# EasyEDA schematic SCH_Pult-v1.0_2025-10-03.json

## Sheets
1 HighSpeed
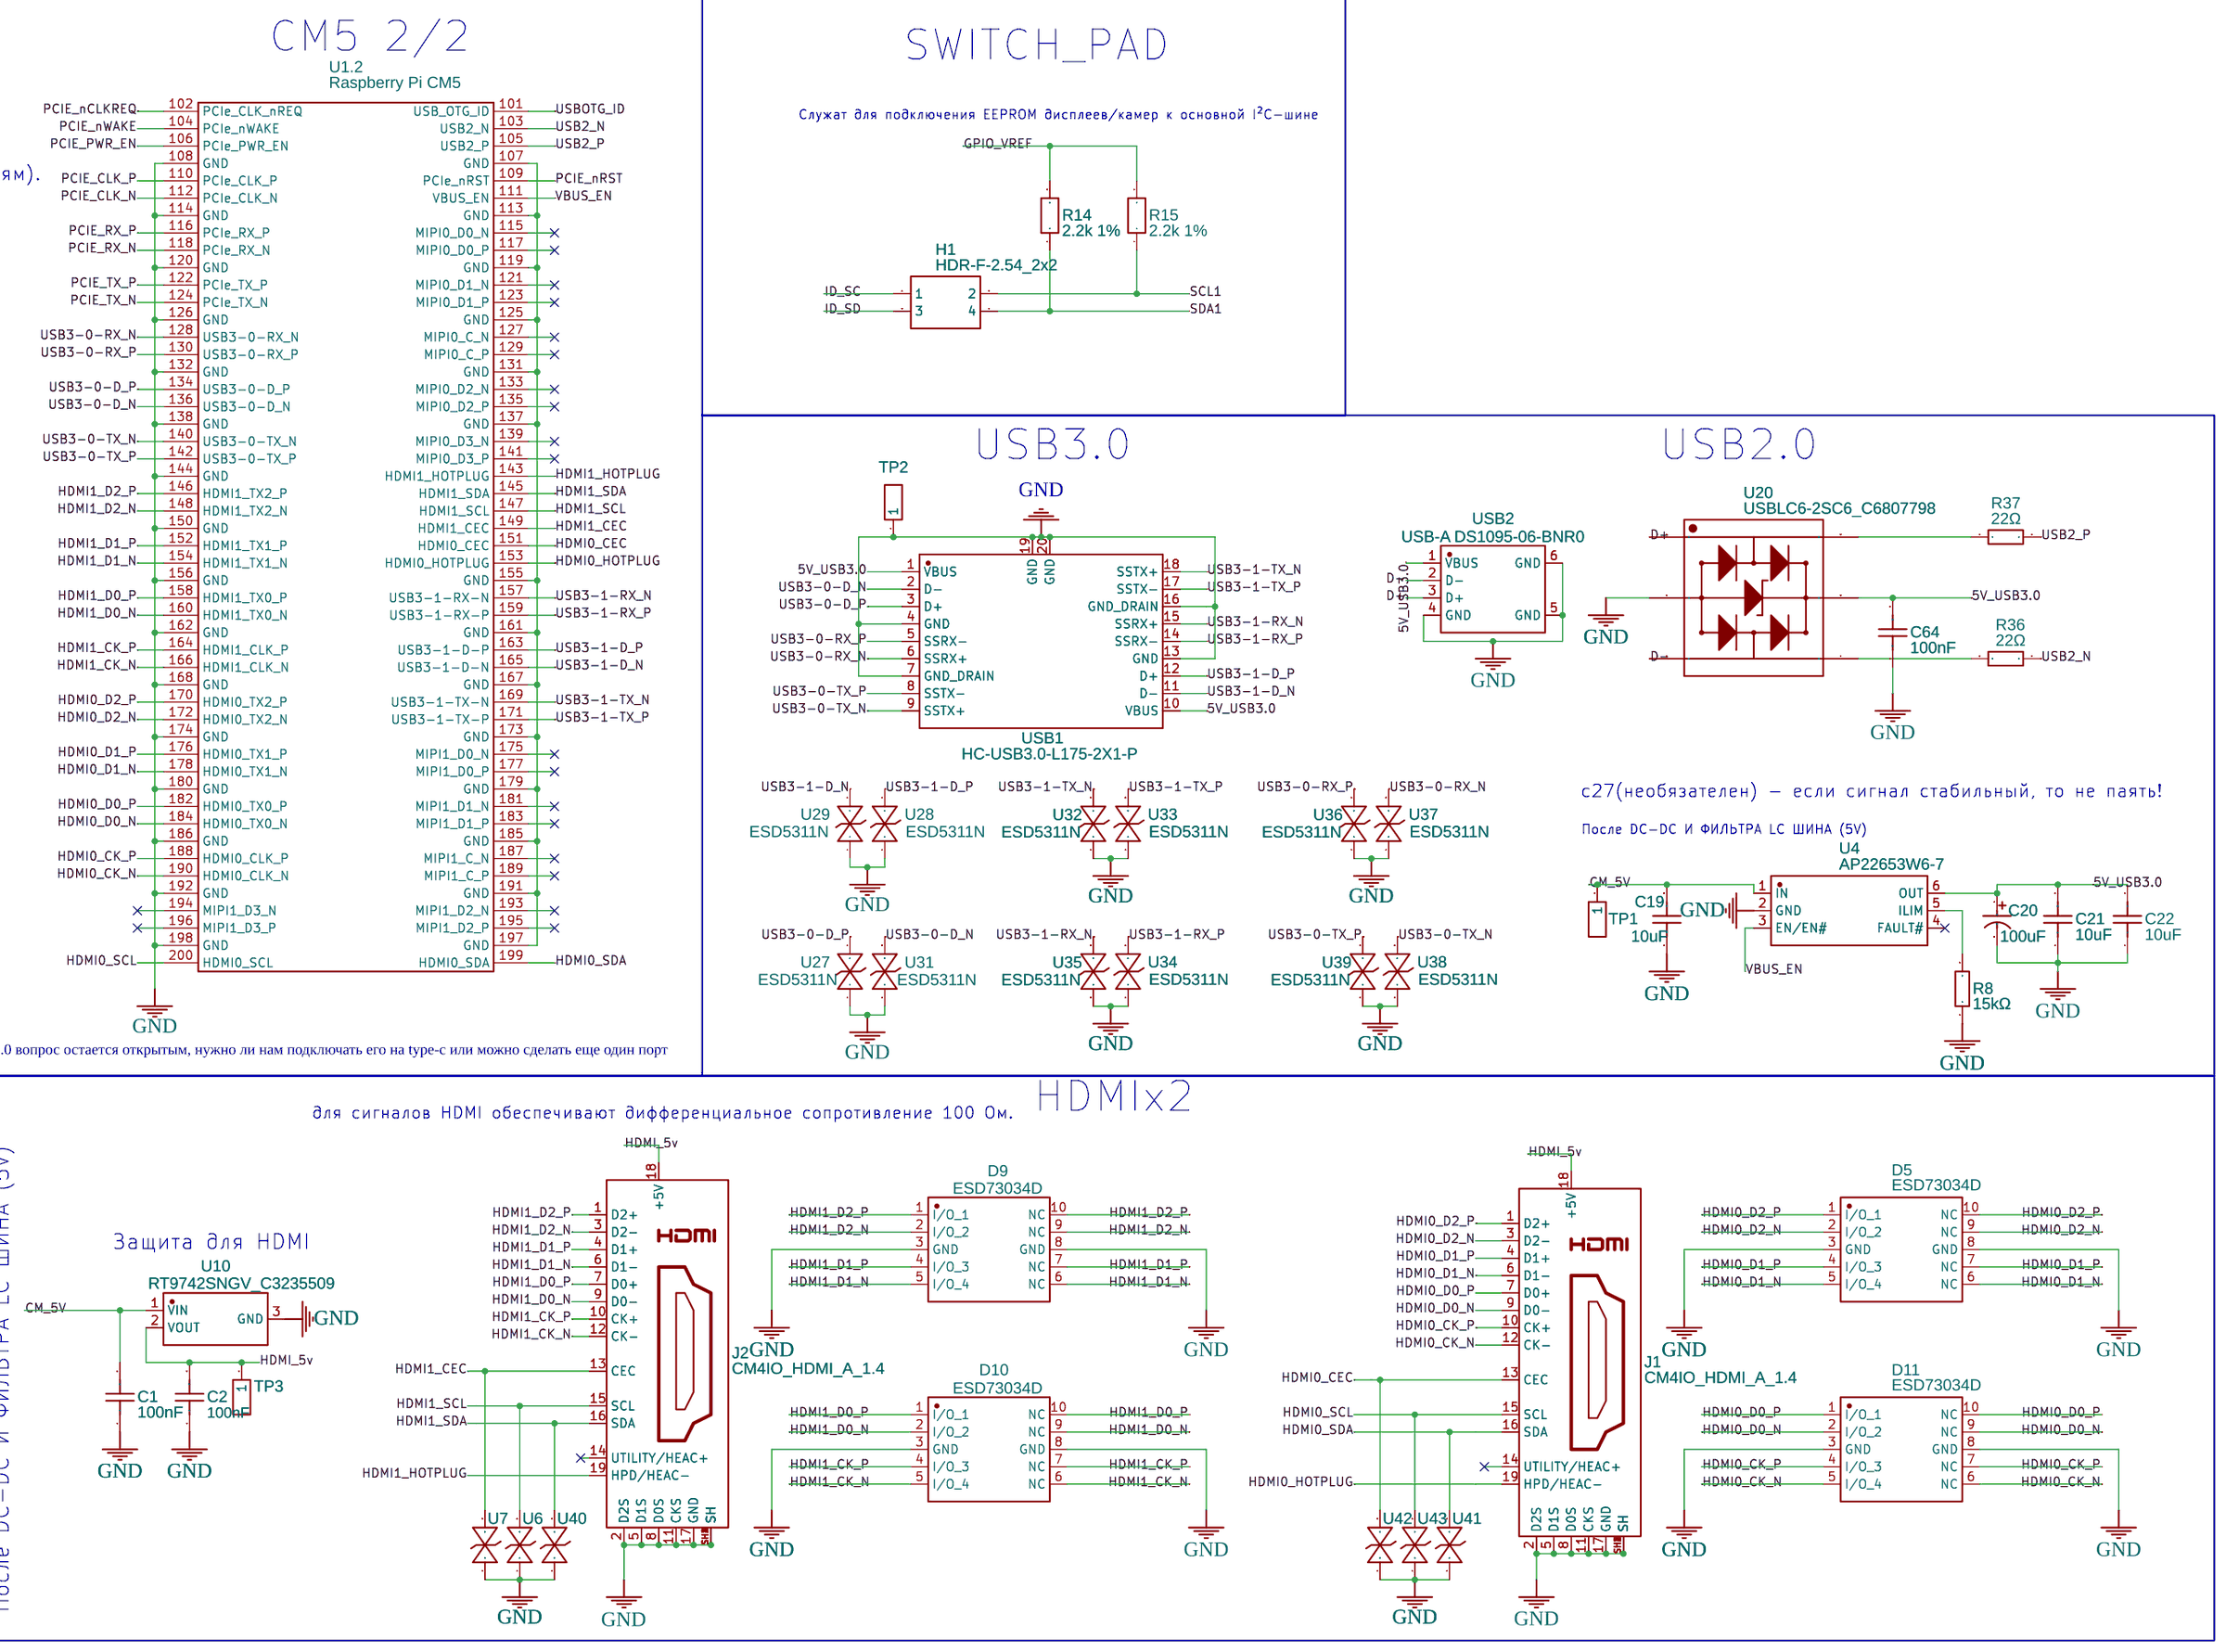
[diagram p0: HighSpeed]
2 Power Source ＆ Charging Circuit
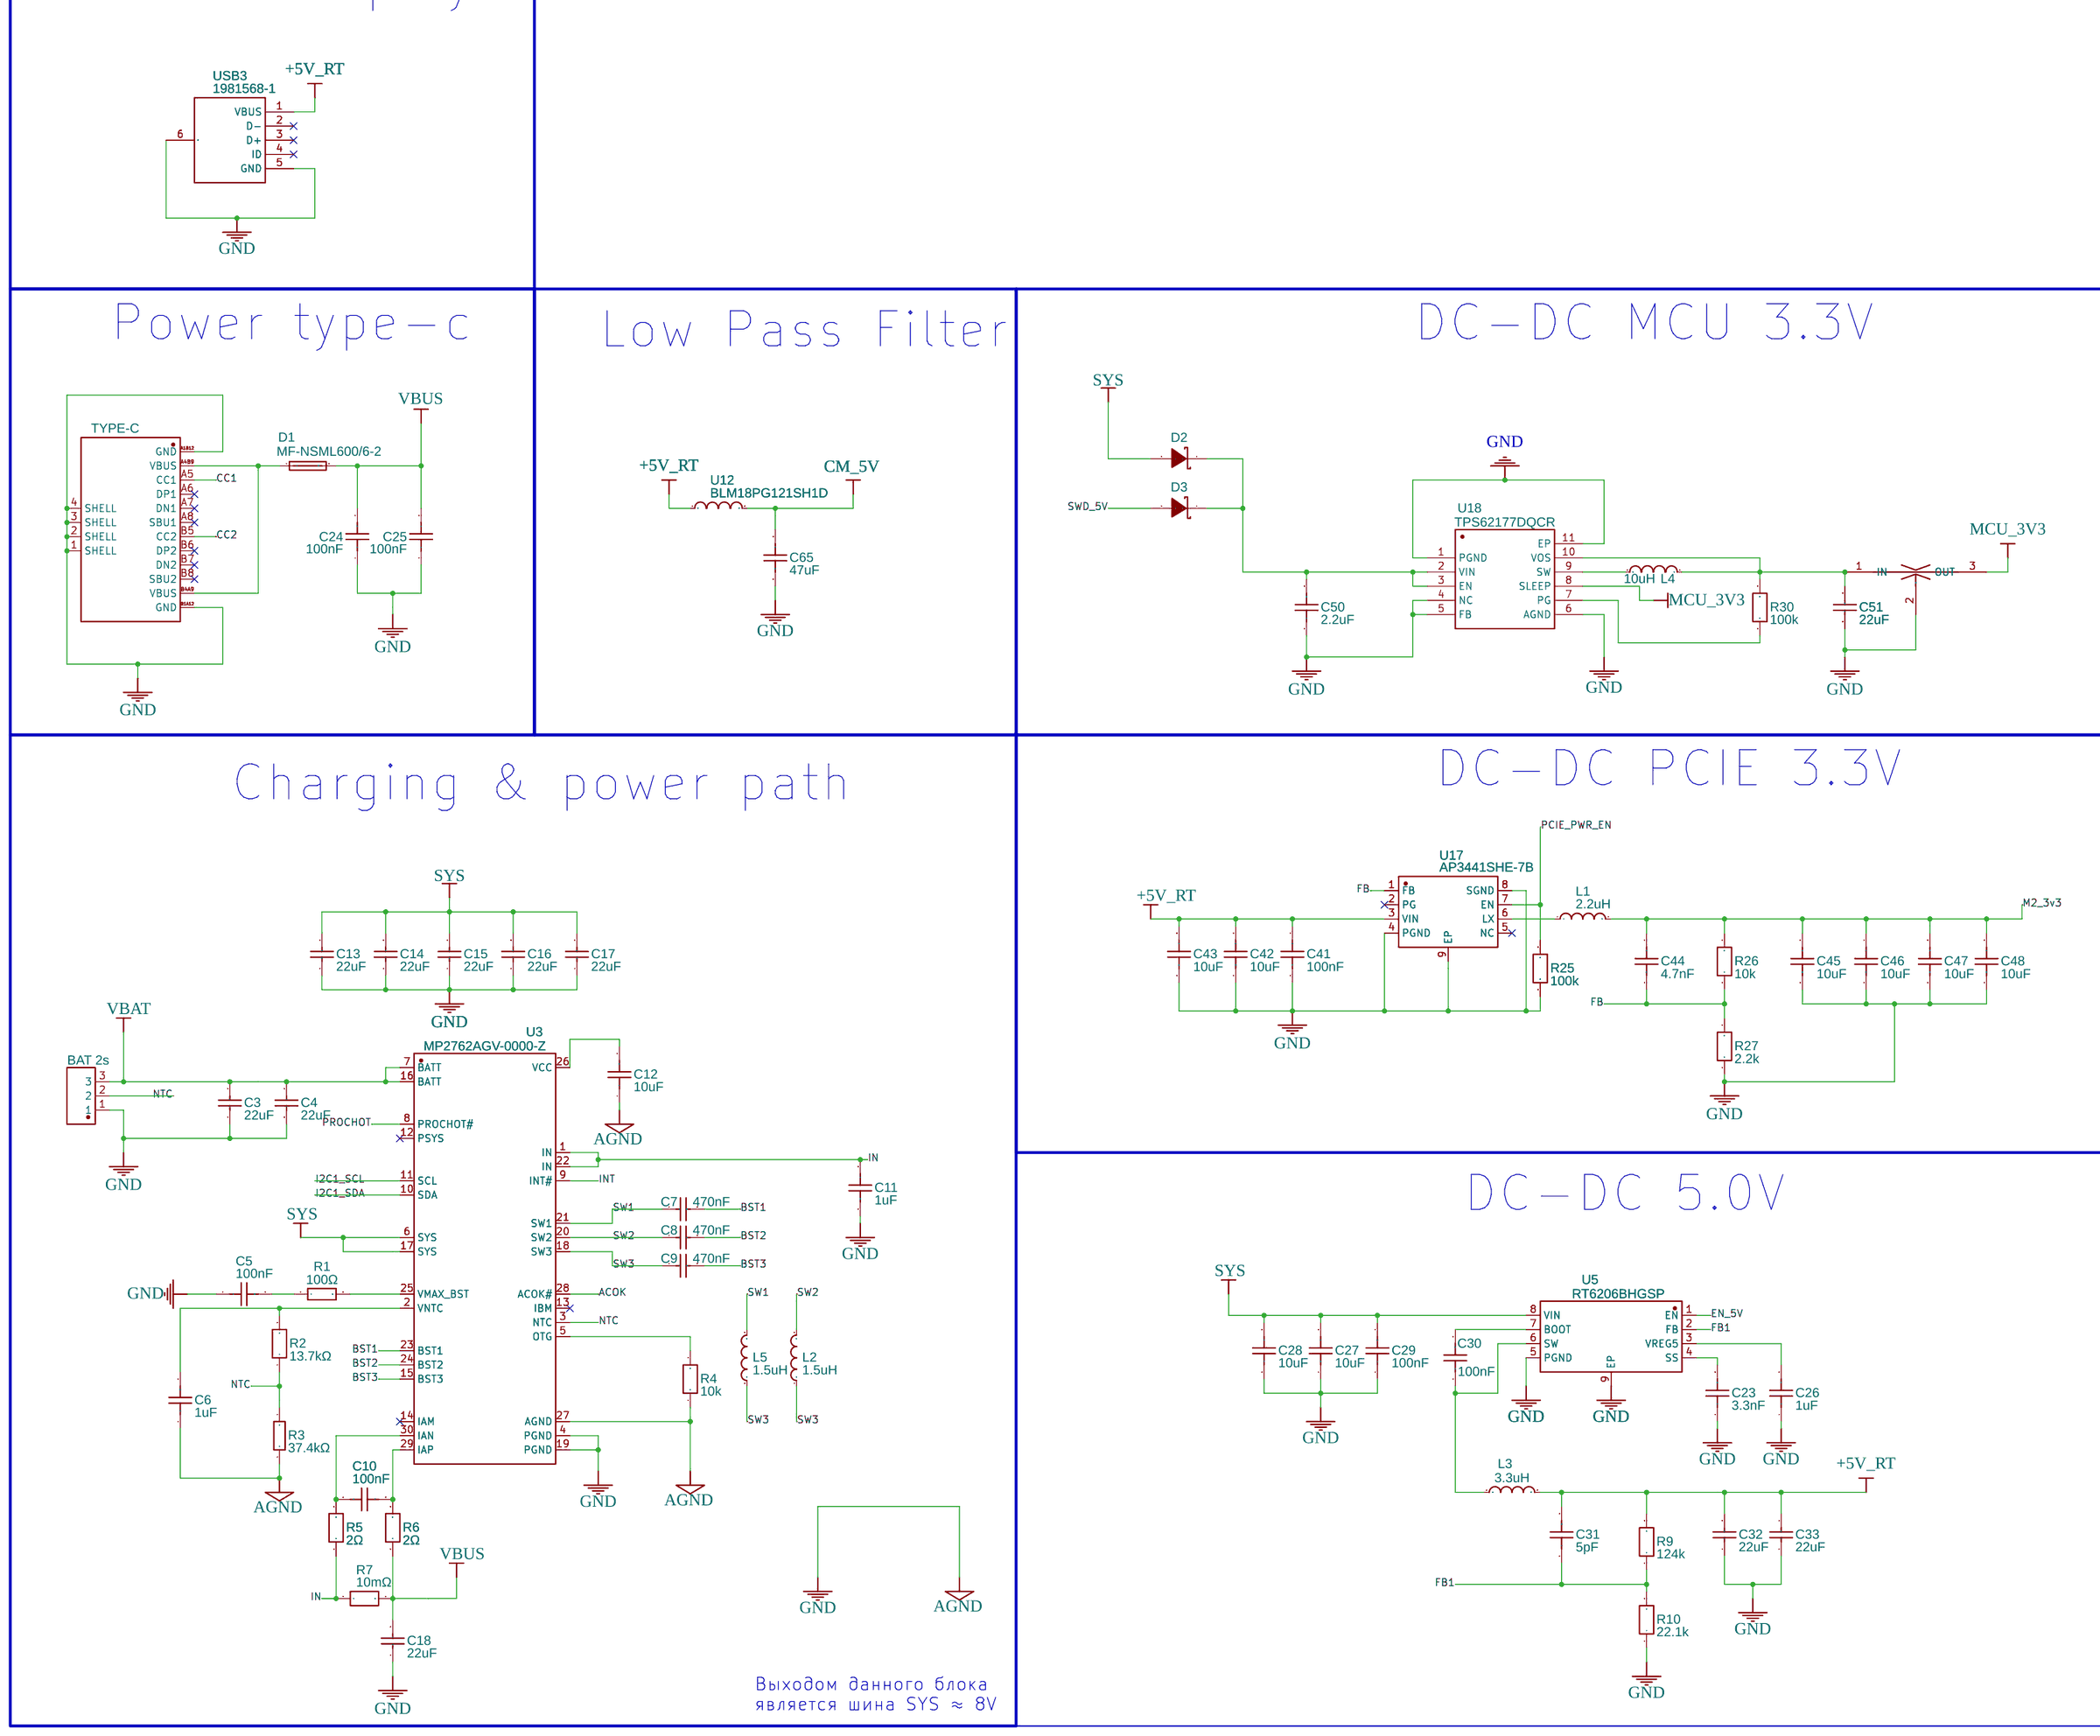
[diagram p1: Power Source ＆ Charging Circuit]
3 GPIO
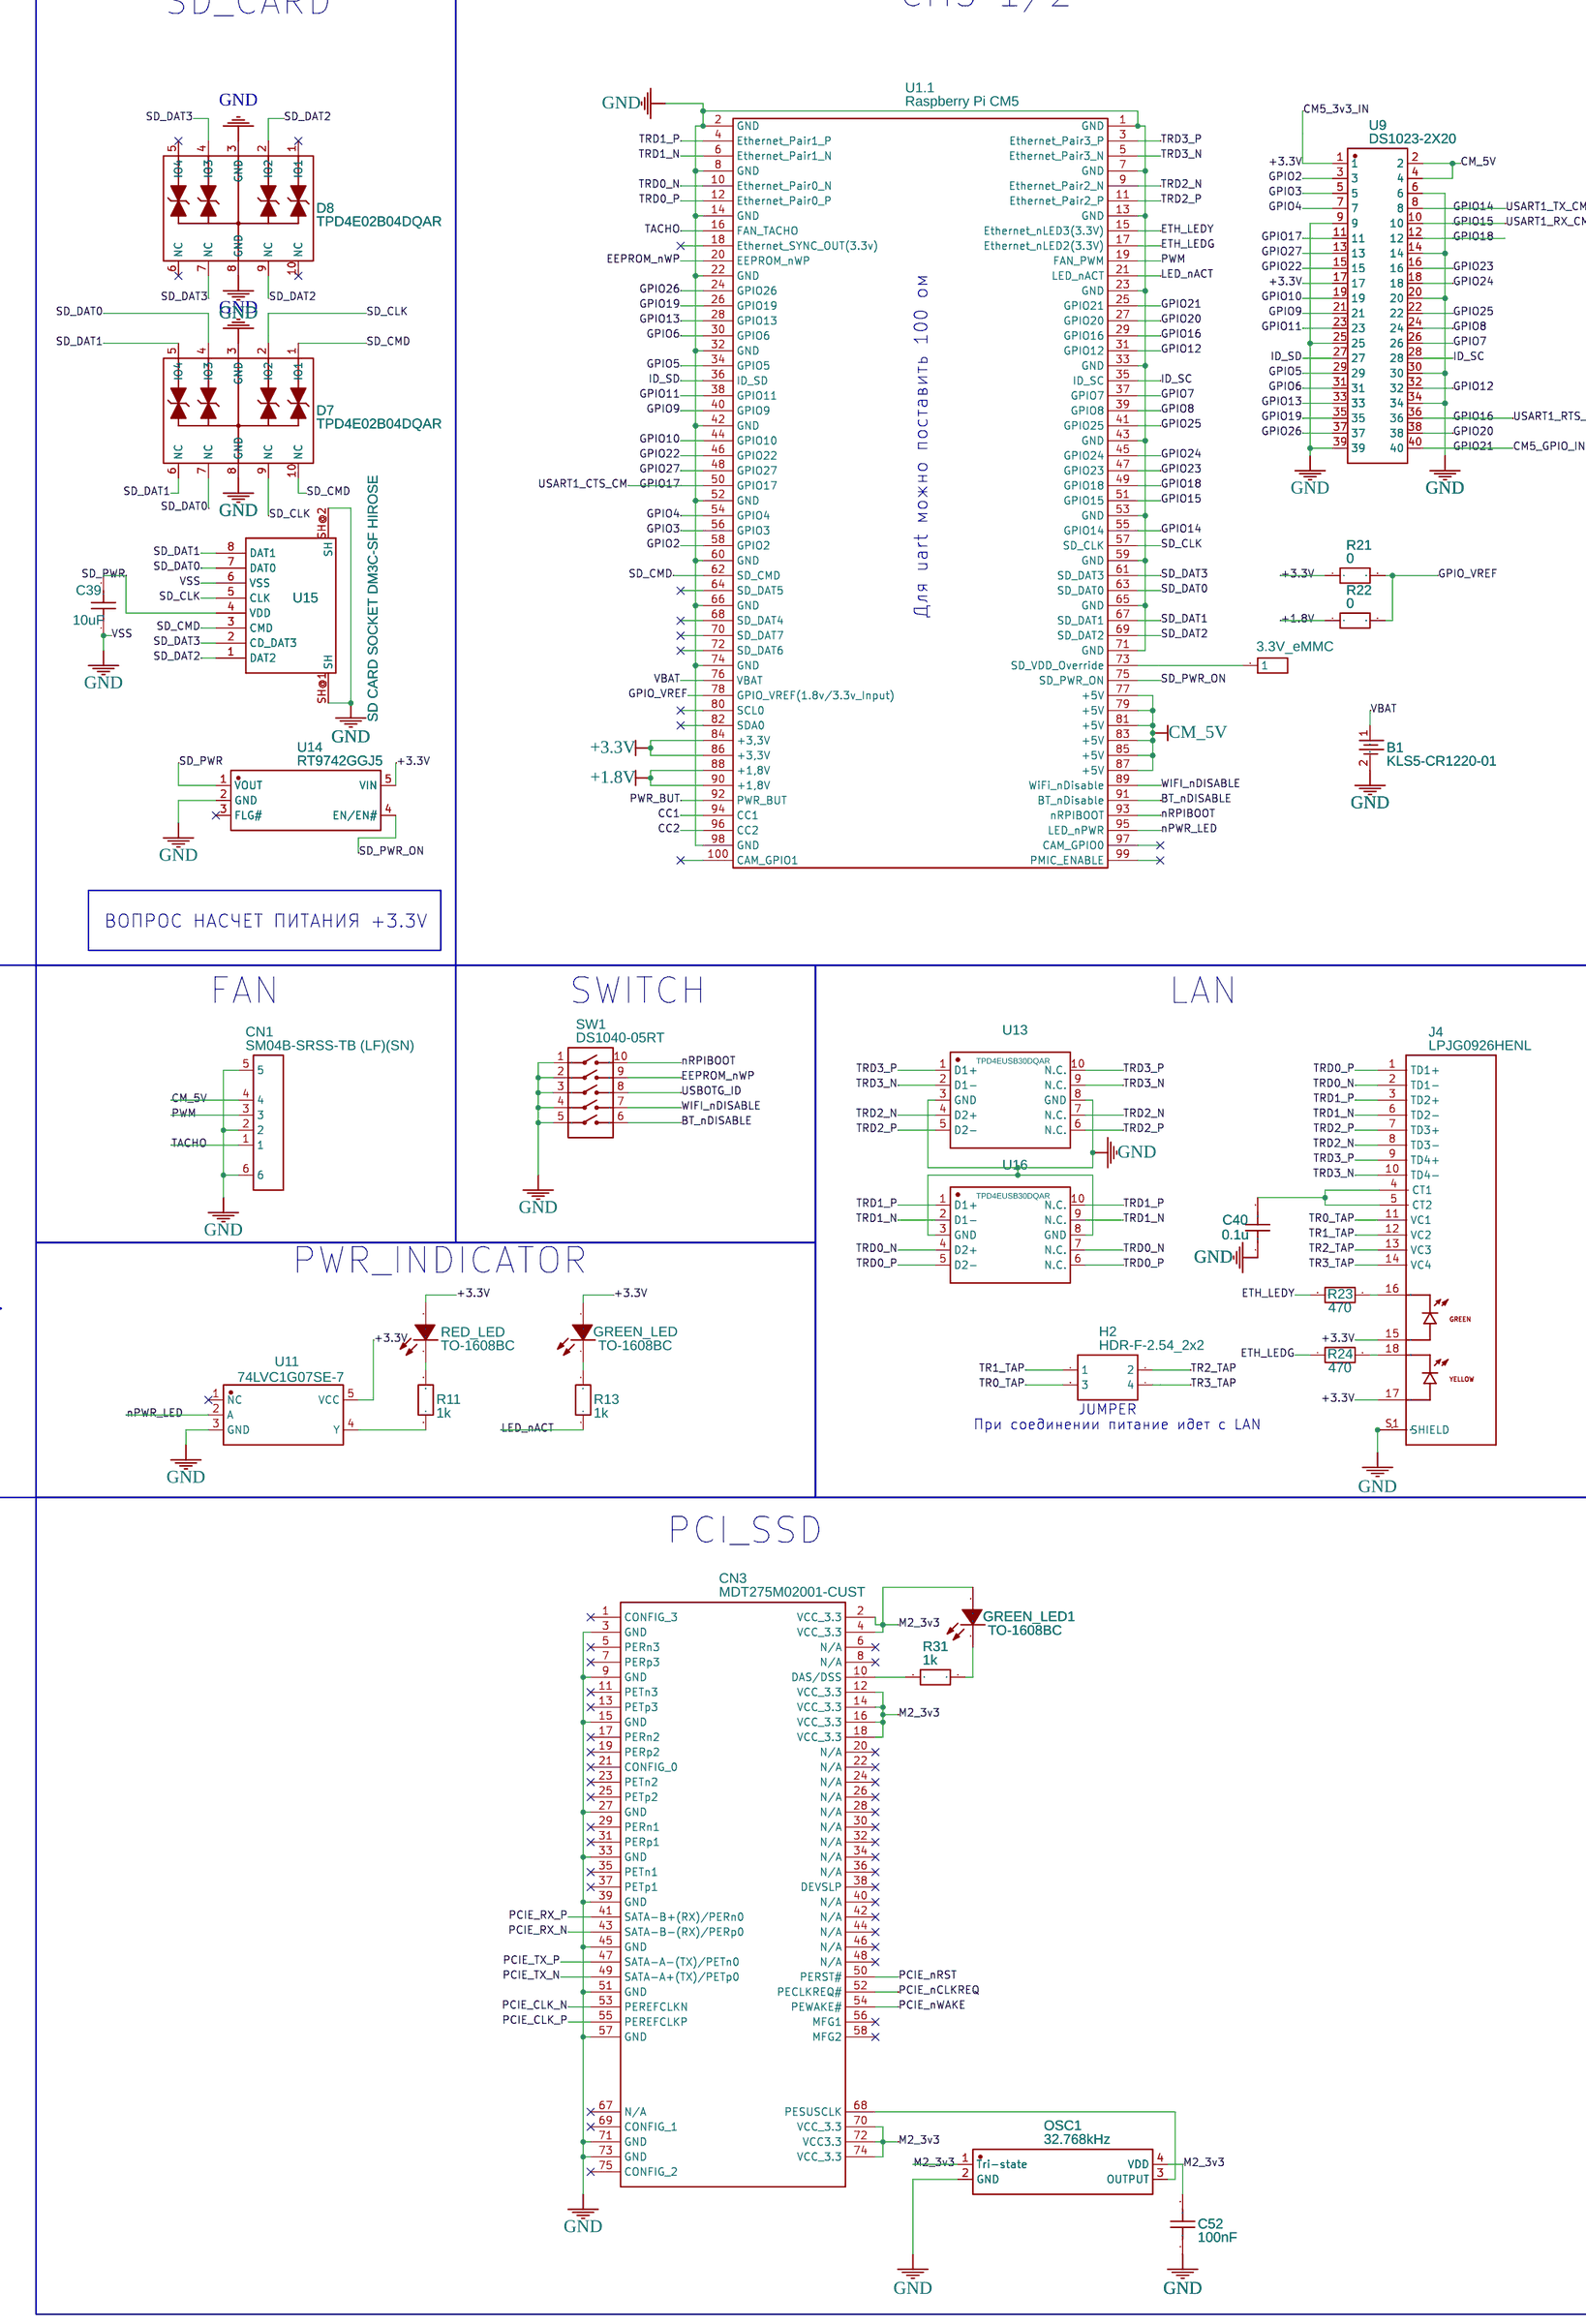
[diagram p2: GPIO]
4 MCU and Stick & Button
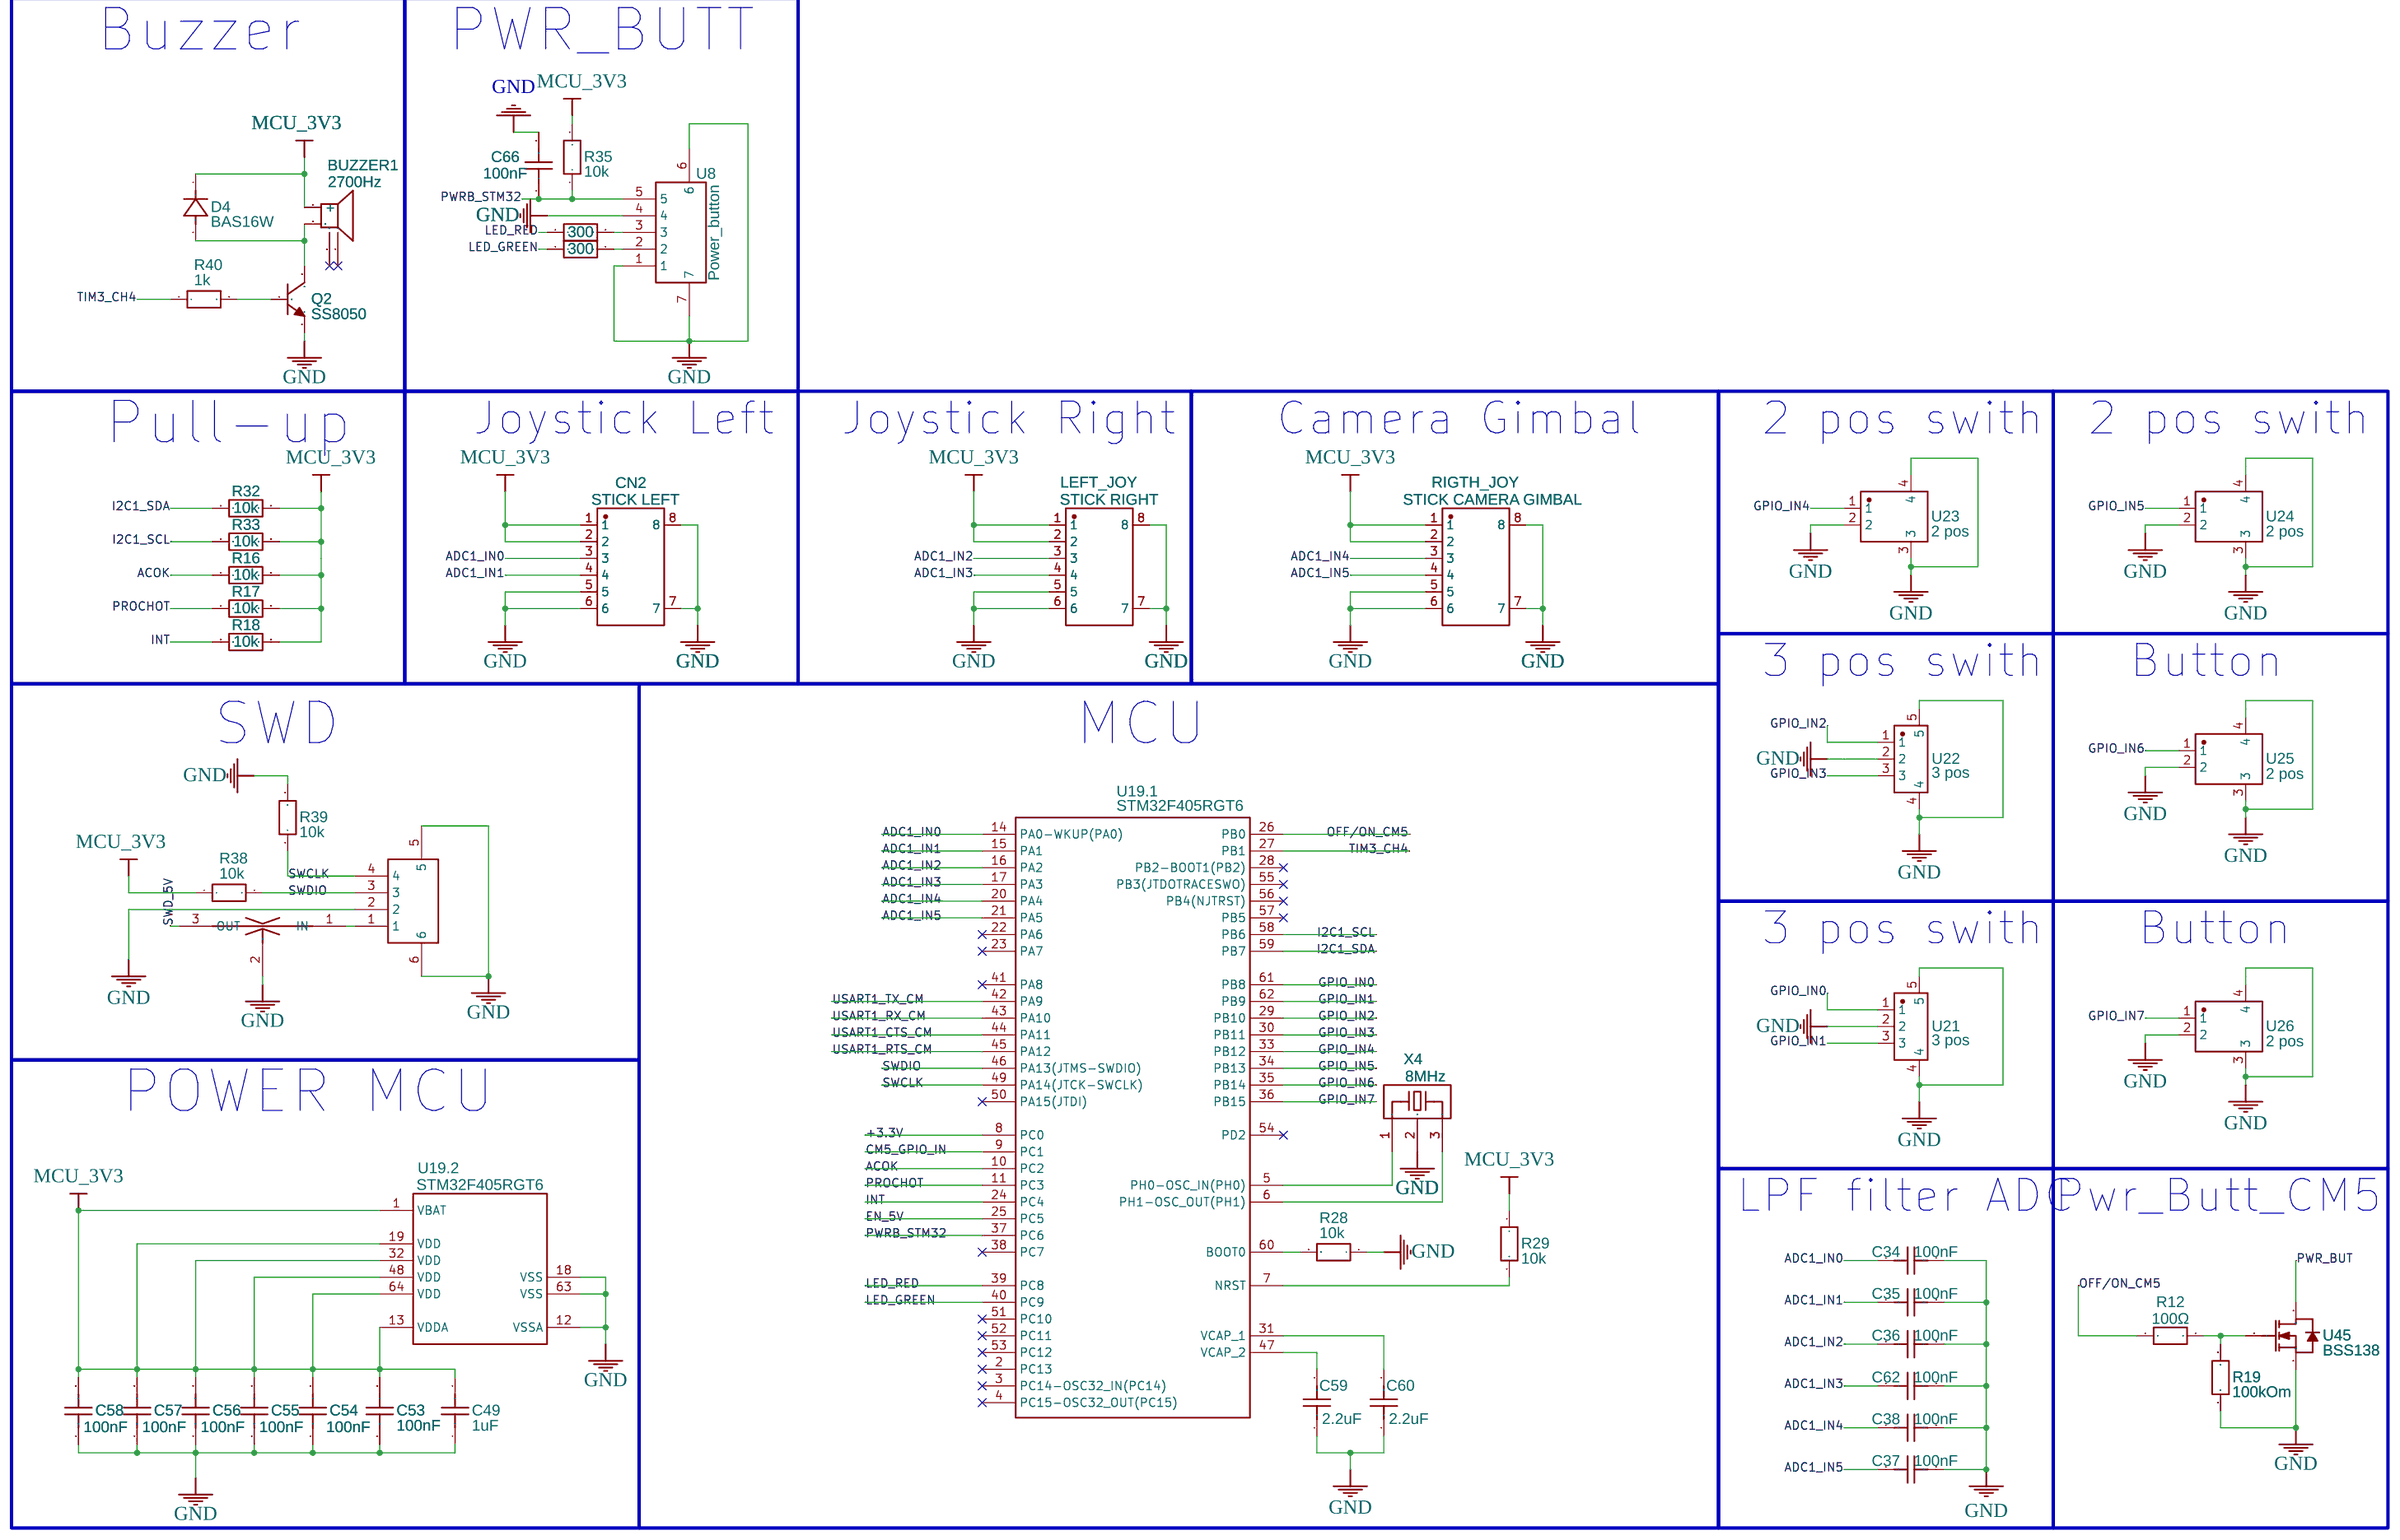
[diagram p3: MCU and Stick & Button]

## Parts
sheet GPIO
B1  KLS5-CR1220-01  [KLS5-CR1220-01]
C39  10uF  [C0603]
C40  0.1u  [C0603]
C52  100nF  [C0603]
CN1  SM04B-SRSS-TB (LF)(SN)  [CONN-SMD_4P-P1.00_SM04B-SRSS-TB-LF-SN]
CN3  MDT275M02001-CUST  [MDT275M02001]
D7  TPD4E02B04DQAR  [USON-10_L2.5-W1.0-P0.50-BL]
D8  TPD4E02B04DQAR  [USON-10_L2.5-W1.0-P0.50-BL]
GREEN_LED  TO-1608BC  [TO-1608BC-MRE]
GREEN_LED1  TO-1608BC  [TO-1608BC-MRE]
H2  HDR-F-2.54_2x2  [HDR-F-2.54_2X2]
J3  3.3V_eMMC  [HDR-M-2.54_1X1]
J4  LPJG0926HENL  [LINK-PP_LPJG0926HENL]
OSC1  32.768kHz  [OSC-SMD_4P-L3.2-W2.5-BL-1]
R11  1k  [R0603]
R13  1k  [R0603]
R21  0  [R0603]
R22  0  [R0603]
R23  470  [R0603]
R24  470  [R0603]
R31  1k  [R0603]
RED_LED  TO-1608BC  [TO-1608BC-MRE]
SW1  DS1040-05RT  [SW-TH_10P-P2.54_DS1040-05RN]
U1  Raspberry Pi CM5  [RASPBERRY_PI_CM5]  (sections 1,2)
U9  DS1023-2X20  [HDR-TH_40P-P2.00-V-F-R2-C20-S2.00]
U11  74LVC1G07SE-7  [SC-88A_L2.0-W1.3-P0.65-LS2.1-BL]
U13  TPD4EUSB30DQAR  [USON-10_L2.5-W1.0-P0.50-BL]
U14  RT9742GGJ5  [TSOT-23-5_L2.9-W1.6-P0.95-LS2.8-BR]
U15  SD CARD SOCKET DM3C-SF HIROSE  [SD_1:1]
U16  TPD4EUSB30DQAR  [USON-10_L2.5-W1.0-P0.50-BL]
sheet HighSpeed
C1  100nF  [C0603]
C2  100nF  [C0603]
C19  10uF  [C0603]
C20  100uF  [CAP-SMD_BD6.3-L6.6-W6.6-LS7.6-FD]
C21  10uF  [C0603]
C22  10uF  [C0603]
C64  100nF  [C0402]
D5  ESD73034D  [DFN-10_L2.5-W1.0-P0.50-BL-2]
D9  ESD73034D  [DFN-10_L2.5-W1.0-P0.50-BL-2]
D10  ESD73034D  [DFN-10_L2.5-W1.0-P0.50-BL-2]
D11  ESD73034D  [DFN-10_L2.5-W1.0-P0.50-BL-2]
H1  HDR-F-2.54_2x2  [HDR-F-2.54_2X2]
J1  CM4IO_HDMI_A_1.4  [CM4IO:EDAC 690-019-298-412]
J2  CM4IO_HDMI_A_1.4  [CM4IO:EDAC 690-019-298-412]
R8  15kΩ  [R0603]
R14  2.2k 1%  [R0603]
R15  2.2k 1%  [R0603]
R36  22Ω  [R0402]
R37  22Ω  [R0402]
TP1  HDR-M-2.54_1x1  [HDR-M-2.54_1X1]
TP2  HDR-M-2.54_1x1  [HDR-M-2.54_1X1]
TP3  HDR-M-2.54_1x1  [HDR-M-2.54_1X1]
U4  AP22653W6-7  [SOT-23-6_L2.9-W1.6-P0.95-LS2.8-BR]
U6  ESD5311N  [DFN1006-2L-BI]
U7  ESD5311N  [DFN1006-2L-BI]
U10  RT9742SNGV_C3235509  [SOT-23-3_L2.9-W1.6-P1.90-LS2.8-BR]
U20  USBLC6-2SC6_C6807798  [SOT-23-6_L2.9-W1.6-P0.95-LS2.8-BL]
U27  ESD5311N  [DFN1006-2L-BI]
U28  ESD5311N  [DFN1006-2L-BI]
U29  ESD5311N  [DFN1006-2L-BI]
U31  ESD5311N  [DFN1006-2L-BI]
U32  ESD5311N  [DFN1006-2L-BI]
U33  ESD5311N  [DFN1006-2L-BI]
U34  ESD5311N  [DFN1006-2L-BI]
U35  ESD5311N  [DFN1006-2L-BI]
U36  ESD5311N  [DFN1006-2L-BI]
U37  ESD5311N  [DFN1006-2L-BI]
U38  ESD5311N  [DFN1006-2L-BI]
U39  ESD5311N  [DFN1006-2L-BI]
U40  ESD5311N  [DFN1006-2L-BI]
U41  ESD5311N  [DFN1006-2L-BI]
U42  ESD5311N  [DFN1006-2L-BI]
U43  ESD5311N  [DFN1006-2L-BI]
USB1  HC-USB3.0-L175-2X1-P  [USB-A-TH_H181-AF2R06-12ALCR]
USB2  USB-A DS1095-06-BNR0  [USB-A DS1095-06-BNR)]
sheet MCU and Stick & Button
BUZZER1  2700Hz  [BUZ-SMD_4P-L8.5-W8.5-P8.50-BR]
C34  100nF  [C0603]
C35  100nF  [C0603]
C36  100nF  [C0603]
C37  100nF  [C0603]
C38  100nF  [C0603]
C49  1uF  [C0603]
C53  100nF  [C0603]
C54  100nF  [C0603]
C55  100nF  [C0603]
C56  100nF  [C0603]
C57  100nF  [C0603]
C58  100nF  [C0603]
C59  2.2uF  [C0603]
C60  2.2uF  [C0603]
C61  -  [FILTER-SMD_3P-L1.6-W0.8-L_NFM18CC223R1C3D]
C62  100nF  [C0603]
C66  100nF  [C0603]
CN2  STICK LEFT  [CONN-TH_SM06B-GHS-TB-LF-SN]
D4  BAS16W  [SOD-123_L2.7-W1.6-LS3.7-RD]
LEFT_JOY  STICK RIGHT  [CONN-TH_SM06B-GHS-TB-LF-SN]
Q2  SS8050  [SOT-23-3_L2.9-W1.3-P1.90-LS2.4-BR]
R12  100Ω  [R0402]
R16  10k  [R0603]
R17  10k  [R0603]
R18  10k  [R0603]
R19  100kOm  [R0402]
R20  300  [R0603]
R28  10k  [R0603]
R29  10k  [R0603]
R32  10k  [R0603]
R33  10k  [R0603]
R34  300  [R0603]
R35  10k  [R0603]
R38  10k  [R0603]
R39  10k  [R0603]
R40  1k  [R0603]
RIGTH_JOY  STICK CAMERA GIMBAL  [CONN-TH_SM06B-GHS-TB-LF-SN]
U8  Power_button  [CONN-SMD_5P-P1.25_SM05B-GHS-TB-LF-SN]
U19  STM32F405RGT6  [LQFP-64_L10.0-W10.0-P0.50-LS12.0-BL]  (sections 1,2)
U21  3 pos  [CONN-TH_SM03B-GHS-TB-LF-SN]
U22  3 pos  [CONN-TH_SM03B-GHS-TB-LF-SN]
U23  2 pos  [CONN-SMD_SM02B-GHS-TB-LF-SN]
U24  2 pos  [CONN-SMD_SM02B-GHS-TB-LF-SN]
U25  2 pos  [CONN-SMD_SM02B-GHS-TB-LF-SN]
U26  2 pos  [CONN-SMD_SM02B-GHS-TB-LF-SN]
U30  SM04B-GHS-TB(LF)(SN)  [CONN-SMD_4P-P1.25_SM04B-GHS-TB-LF-SN]
U45  BSS138  [SOT-23-3_L2.9-W1.4-P1.90-LS2.5-BR]
X4  8MHz  [OSC-SMD_3P-L3.2-W1.3-P1.2-L]
sheet Power Source ＆ Charging Circuit
C3  22uF  [C0805]
C4  22uF  [C0805]
C5  100nF  [C0603]
C6  1uF  [C0603]
C7  470nF  [C0603]
C8  470nF  [C0603]
C9  470nF  [C0603]
C10  100nF  [C0603]
C11  1uF  [C0603]
C12  10uF  [C0603]
C13  22uF  [C0805]
C14  22uF  [C0805]
C15  22uF  [C0805]
C16  22uF  [C0805]
C17  22uF  [C0805]
C18  22uF  [C0805]
C23  3.3nF  [C0603]
C24  100nF  [C0603]
C25  100nF  [C0603]
C26  1uF  [C0603]
C27  10uF  [C0603]
C28  10uF  [C0603]
C29  100nF  [C0603]
C30  100nF  [C0603]
C31  5pF  [C0603]
C32  22uF  [C0805]
C33  22uF  [C0805]
C41  100nF  [C0603]
C42  10uF  [C0603]
C43  10uF  [C0603]
C44  4.7nF  [C0603]
C45  10uF  [C0603]
C46  10uF  [C0603]
C47  10uF  [C0603]
C48  10uF  [C0603]
C50  2.2uF  [C0603]
C51  22uF  [C0805]
C63  -  [FILTER-SMD_3P-L1.6-W0.8-L_NFM18CC223R1C3D]
C65  47uF  [C0603]
D1  MF-NSML600/6-2  [F1206]
D2  BAT60AE6327HTSA1  [SOD-323_L1.8-W1.3-LS2.5-RD]
D3  BAT60AE6327HTSA1  [SOD-323_L1.8-W1.3-LS2.5-RD]
L1  2.2uH  [IND-SMD_L3.0-W3.0_IHLP-1212BZ]
L2  1.5uH  [IND-SMD_L5.5-W5.2]
L3  3.3uH  [IND-SMD_L6.5-W6.5_IHLP-2525]
L4  10uH  [IND-SMD_L4.0-W4.0_VLCF4020]
L5  1.5uH  [IND-SMD_L5.5-W5.2]
R1  100Ω  [R0603]
R2  13.7kΩ  [R0603]
R3  37.4kΩ  [R0603]
R4  10k  [R0603]
R5  2Ω  [R0603]
R6  2Ω  [R0603]
R7  10mΩ  [R1206]
R9  124k  [R0603]
R10  22.1k  [R0603]
R25  100k  [R0603]
R26  10k  [R0603]
R27  2.2k  [R0603]
R30  100k  [R0603]
U2  BAT 2s  [CONN-TH_XH2.54-3P]
U3  MP2762AGV-0000-Z  [QFN-30_L5.0-W4.0-P0.50-TL_MP2762A]
U5  RT6206BHGSP  [SOP-8_L4.9-W3.9-P1.27-LS6.0-BL-EP-2]
U12  BLM18PG121SH1D  [L0603]
U17  AP3441SHE-7B  [DFN2020-8_L2.0-W2.0-P0.50-BL-EP]
U18  TPS62177DQCR  [WSON-10_L3.0-W2.0-P0.50-BL-EP]
U44  TYPE-C  [USB-C-SMD_TYPE-C16PIN-SHOUHAN]
USB3  1981568-1  [MICRO-USB-SMD_1981568-1]

## Library data of the parts
B1 = KLS5-CR1220-01: Manufacturer Part: CR1220-2; image: //image.lceda.cn/szlcsc/C70381.jpg; Contributor: LCSC
C19 C21 C22 C39 = GRM188R61C106KAALD: Contributor: LCSC; Supplier: LCSC; Supplier Part: C86275; Manufacturer: muRata(村田); JLCPCB Part Class: Extended Part
C6 C23 C26-C31 C34-C38 C40-C50 C53-C60 C62 C65 C66 = C_0603_US: Contributor: LCEDA_Lib
C1 C2 C52 = GRM188R72A104KA35D: Supplier: LCSC; Manufacturer: muRata(村田); Supplier Part: C77058; JLCPCB Part Class: Extended Part
CN1 = SM04B-SRSS-TB (LF)(SN): Contributor: LCSC; Supplier: LCSC; Supplier Part: C160404; Manufacturer: JST; Manufacturer Part: SM04B-SRSS-TB(LF)(SN); JLCPCB Part Class: Extended Part
CN3 = MDT275M02001-CUST: Manufacturer: Amphenol FCI; Supplier Part: 523-MDT275M02001; Supplier: Mouser; Contributor: lastmins69
D7 D8 = TPD4E02B04DQAR: Contributor: LCSC; Supplier: LCSC; Supplier Part: C106794; Manufacturer: TI(德州仪器); JLCPCB Part Class: Extended Part
GREEN_LED GREEN_LED1 RED_LED = TO-1608BC: Contributor: Practical Electronic
H1 H2 = HDR-F-2.54_2x2: Supplier Part: C239342; Supplier: LCSC; Contributor: LCEDA_Lib
J3 TP1-TP3 = HDR-M-2.54_1x1: Supplier Part: C81276; Supplier: LCSC; Contributor: LCEDA_Lib
J4 = LPJG0926HENL: Contributor: christiansantibanez
OSC1 = ASEK-32.768KHZ-LRT: Contributor: lcsc; Supplier: LCSC; Supplier Part: C2650753; Manufacturer: ABRACON; JLCPCB Part Class: Extended Part
R2 R4-R6 R9-R11 R13-R18 R20-R35 R38-R40 = R_0603_EU: Contributor: LCEDA_Lib
SW1 = DS1040-05RT: Contributor: beijinger
U1 = Raspberry Pi CM5: Contributor: RobMel; subpart_no: 1
U9 = X4621FV-2X20-C43D28: Contributor: LCSC; Supplier: LCSC; Supplier Part: C2883245; Manufacturer: XKB Connection(中国星坤); Manufacturer Part: X4621FV-2x20-C43D28; JLCPCB Part Class: Extended Part
U11 = 74LVC1G07SE-7: Contributor: LCSC; Supplier: LCSC; Supplier Part: C67531; Manufacturer: DIODES(美台); JLCPCB Part Class: Extended Part
U13 U16 = TPD4EUSB30DQAR: Contributor: LCSC; Supplier: LCSC; Manufacturer: TI(德州仪器); Supplier Part: C90627; JLCPCB Part Class: Extended Part
U14 = RT9742GGJ5: Contributor: LCSC; Supplier: LCSC; Supplier Part: C250547; Manufacturer: RICHTEK(立锜); JLCPCB Part Class: Extended Part
U15 = SD CARD SOCKET DM3C-SF HIROSE: SD Memory Card Connector, push-push normal type, CD enable, WP enable; Contributor: Engenharia 2 R & D Mediq
C20 = EEEFK1E101XP: Supplier: LCSC; Manufacturer: PANASONIC(松下); Supplier Part: C128510; JLCPCB Part Class: Extended Part
C64 = GCM155R71A104KA55D: Contributor: LCSC; Supplier: LCSC; Supplier Part: C161163; Manufacturer: muRata(村田); JLCPCB Part Class: Extended Part
D5 D9-D11 = ESD73034D: Supplier: LCSC; Supplier Part: C7202962; Manufacturer: TECH PUBLIC(台舟); JLCPCB Part Class: Extended Part; Contributor: lcsc
J1 J2 = CM4IO_HDMI_A_1.4: field4: Farnell; field5: 2614936; field6: 690-019-298-412; field7: EDAC; field8: UCON00802; part description: HDMI Connector, Right Angle, 19 Contacts, Receptacle, Surface Mount, Surface Mount Right Angle; User doc link: https://www.tme.eu/Document/f15dffbcfad8545e17826f72d36911c8/206A-SEAN-R03.pdf; Add into BOM: yes; Convert to PCB: yes; Origin Footprint: CM4IO:EDAC 690-019-298-412; Field4: Farnell; Field5: 2614936; Field6: 690-019-298-412; Field7: EDAC; Part Description: HDMI Connector, Right Angle, 19 Contacts, Receptacle, Surface Mount, Surface Mount Right Angle; Field8: UCON00802; Contributor: Steve Forest
R8 = RC0603FR-0715KL: Supplier: LCSC; Manufacturer: YAGEO(国巨); Supplier Part: C114661; JLCPCB Part Class: Extended Part
R36 R37 = RC0402FR-0722RL: Supplier: LCSC; Manufacturer: YAGEO(国巨); Supplier Part: C114765; JLCPCB Part Class: Extended Part
U4 = AP22653W6-7: Contributor: LCSC; Supplier: LCSC; Supplier Part: C2158037; Manufacturer: DIODES(美台); JLCPCB Part Class: Extended Part
U6 U7 U27-U29 U31-U43 = ESD5311N: Supplier: LCSC; Supplier Part: C2936982; Manufacturer: TECH PUBLIC(台舟); JLCPCB Part Class: Extended Part; Contributor: lcsc
U10 = RT9742SNGV_C3235509: Contributor: lcsc; Supplier: LCSC; Supplier Part: C3235509; Manufacturer: RICHTEK(立锜); Manufacturer Part: RT9742SNGV; JLCPCB Part Class: Extended Part
U20 = USBLC6-2SC6_C6807798: Supplier: LCSC; Supplier Part: C6807798; Manufacturer: FUXINSEMI(富芯森美); Manufacturer Part: USBLC6-2SC6; Contributor: lcsc; JLCPCB Part Class: Extended Part
USB1 = HC-USB3.0-L175-2X1-P: Supplier: LCSC; Supplier Part: C7501881; Manufacturer: HC(虹成电子); Contributor: lcsc; JLCPCB Part Class: Extended Part
USB2 = USB-A DS1095-06-BNR0: Supplier: LCSC; Supplier Part: C720525; Manufacturer: Zhendin; Manufacturer Part: DS1095-06BNR0; Contributor: Рустем Равилов; JLCPCB Part Class: Extended Part; link: https://www.chipdip.ru/product/ds1095-06-bnr0
BUZZER1 = MLT-8530: Supplier: LCSC; Manufacturer: 华能; Supplier Part: C94599; JLCPCB Part Class: Extended Part
C61 C63 = NFM18PC104R1C3D: Supplier: LCSC; Manufacturer: muRata(村田); Supplier Part: C111493; JLCPCB Part Class: Extended Part
CN2 LEFT_JOY RIGTH_JOY = SM06B-GHS-TB(LF)(SN): Contributor: LCSC; Supplier: LCSC; Supplier Part: C133065; Manufacturer: JST; JLCPCB Part Class: Extended Part
D4 = BAS16W_C699061: Contributor: LCSC; Supplier: LCSC; Supplier Part: C699061; Manufacturer: YANGJIE(扬杰); JLCPCB Part Class: Extended Part
Q2 = SS8050: Contributor: LCSC; Supplier: LCSC; Supplier Part: C908250; Manufacturer: FUXINSEMI(富芯森美); JLCPCB Part Class: Extended Part
R12 R19 = R_0402_EU: Contributor: LCEDA_Lib
U8 = SM05B-GHS-TB(LF)(SN): Contributor: LCSC; Supplier: LCSC; Supplier Part: C189896; Manufacturer: JST; JLCPCB Part Class: Extended Part
U19 = STM32F405RGT6: tags: STM32; subpart_no: 1; image: http://image.lceda.cn/szlcsc/C15742.jpg; Supplier Part: C15742; Supplier: LCSC; Manufacturer: ST(意法半导体); JLCPCB Part Class: Extended Part
U21 U22 = SM03B-GHS-TB(LF)(SN): Contributor: LCSC; Supplier: LCSC; Supplier Part: C514175; Manufacturer: JST; JLCPCB Part Class: Extended Part
U23-U26 = SM02B-GHS-TB(LF)(SN): Contributor: LCSC; Supplier: LCSC; Supplier Part: C189893; Manufacturer: JST; JLCPCB Part Class: Extended Part
U30 = SM04B-GHS-TB(LF)(SN): Contributor: LCSC; Supplier: LCSC; Supplier Part: C189895; Manufacturer: JST; JLCPCB Part Class: Extended Part
U45 = BSS138: Supplier: LCSC; Supplier Part: C19272192; Manufacturer: Zhengxin(正芯); Contributor: lcsc
X4 = CSTCE8M00G52-R0: Supplier: LCSC; Manufacturer: muRata(村田); Supplier Part: C22549; JLCPCB Part Class: Extended Part
C3 C4 C13-C18 C32 C33 C51 = GRM21BR61E226ME44L: Supplier: LCSC; Manufacturer: muRata(村田); Supplier Part: C86816; JLCPCB Part Class: Extended Part
C5 C10 C24 C25 = CC0603KRX7R0BB104: Contributor: LCSC; Supplier: LCSC; Supplier Part: C113803; Manufacturer: YAGEO(国巨); JLCPCB Part Class: Extended Part
C7-C9 = CL10B474KA8NNNC: Supplier: LCSC; Manufacturer: SAMSUNG(三星); Supplier Part: C1623; JLCPCB Part Class: Basic Part
C11 C12 = GRM188R61A105KA61D: Supplier: LCSC; Manufacturer: muRata(村田); Supplier Part: C86012; JLCPCB Part Class: Extended Part
D1 = MF-NSML600/6-2: Contributor: LCSC; Supplier: LCSC; Supplier Part: C1972893; Manufacturer: BOURNS; JLCPCB Part Class: Extended Part
D2 D3 = BAT60AE6327HTSA1: Contributor: LCSC; Supplier: LCSC; Supplier Part: C117485; Manufacturer: Infineon(英飞凌); Manufacturer Part: BAT60AE6327; JLCPCB Part Class: Extended Part
L1 = IHLP1212BZER2R2M11: Contributor: LCSC; Supplier: LCSC; Supplier Part: C553996; Manufacturer: VISHAY(威世); JLCPCB Part Class: Extended Part
L2 L5 = IHLP2020CZER2R2M01: Contributor: lcsc; Supplier: LCSC; Supplier Part: C845003; Manufacturer: VISHAY(威世); JLCPCB Part Class: Extended Part
L3 = IHLP2525CZER3R3M01: Contributor: LCSC; Supplier: LCSC; Supplier Part: C506574; Manufacturer: VISHAY(威世); JLCPCB Part Class: Extended Part
L4 = VLCF4020T-100MR85: Contributor: LCSC; Supplier: LCSC; Manufacturer: TDK; Supplier Part: C136244; JLCPCB Part Class: Extended Part
R1 = AC0603FR-07100RL: Supplier: LCSC; Manufacturer: YAGEO(国巨); Supplier Part: C125923; JLCPCB Part Class: Extended Part
R3 = RC0603FR-0737K4L: Contributor: LCSC; JLCPCB Part Class: Extended Part; Supplier: LCSC; Manufacturer: YAGEO(国巨); Supplier Part: C163425
R7 = WSL1206R0100FEA: Contributor: lcsc; Supplier: LCSC; Supplier Part: C844894; Manufacturer: VISHAY(威世); JLCPCB Part Class: Extended Part
U2 = XH2.54-3P 直插: Contributor: LCSC; Supplier: LCSC; Supplier Part: C9900000727; Manufacturer: null; JLCPCB Part Class: Extended Part
U3 = MP2762AGV-0000-Z: Supplier: LCSC; Supplier Part: C26697965; Manufacturer: MPS(芯源); Contributor: lcsc; JLCPCB Part Class: Extended Part
U5 = RT6206BHGSP: Contributor: LCSC; Supplier: LCSC; Supplier Part: C250401; Manufacturer: RICHTEK(立锜); JLCPCB Part Class: Extended Part
U12 = BLM18PG121SH1D: Contributor: LCSC; Supplier: LCSC; Supplier Part: C354394; Manufacturer: muRata(村田); JLCPCB Part Class: Extended Part
U17 = AP3441SHE-7B: Contributor: LCSC; Supplier: LCSC; Supplier Part: C2070918; Manufacturer: DIODES(美台); JLCPCB Part Class: Extended Part
U18 = TPS62177DQCR: Supplier: LCSC; Manufacturer: TI(德州仪器); Supplier Part: C91241; JLCPCB Part Class: Extended Part
U44 = TYPE-C 母座单排16P四脚插板: Contributor: LCSC; Supplier: LCSC; Supplier Part: C2931349; Manufacturer: null; Manufacturer Part: Type-C 母座单排16P四脚插板
USB3 = 1981568-1: Contributor: LCSC; Supplier: LCSC; Supplier Part: C428487; Manufacturer: TE Connectivity(泰科电子); JLCPCB Part Class: Extended Part

## Nets
5V_USB3.0: C20.1 C21.2 C22.2 C64.1 U4.6(OUT) U20.5(VCC) USB1.1(VBUS) USB1.10(VBUS) USB2.1(VBUS)
+1.8V: R22.1 U1.88(+1,8V) U1.90(+1,8V)
+3.3V: GREEN_LED.1(A) J4.15(GA) J4.17(YA) R21.1 RED_LED.1(A) U1.84(+3,3V) U1.86(+3,3V) U9.1 U9.17 U11.5(VCC) U14.5(VIN) U19.8(PC0)
+5V_RT: C31.2 C32.2 C33.2 C41.2 C42.2 C43.2 L3.2 R9.2 U12.1 U17.3(VIN) USB3.1(VBUS)
AGND: B1.2 C1.1 C2.1 C3.1 C4.1 C5.1 C6.1 C11.1 C12.1 C13.1 C14.1 C15.1 C16.1 C17.1 C18.1 C19.1 C20.2 C21.1 C22.1 C23.1 C24.1 C25.1 C26.1 C27.1 C28.1 C29.1 C32.1 C33.1 C34.2 C35.2 C36.2 C37.2 C38.2 C39.1 C40.1 C41.1 C42.1 C43.1 C45.1 C46.1 C47.1 C48.1 C49.1 C50.1 C51.1 C52.1 C53.1 C54.1 C55.1 C56.1 C57.1 C58.1 C59.1 C60.1 C61.2(GND) C62.2 C63.2(GND) C64.2 C65.1 C66.2 CN1.2 CN1.5 CN1.6 CN2.5 CN2.6 CN2.7 CN2.8 CN3.3(GND) CN3.9(GND) CN3.15(GND) CN3.27(GND) CN3.33(GND) CN3.39(GND) CN3.45(GND) CN3.51(GND) CN3.57(GND) CN3.71(GND) CN3.73(GND) D5.3(GND) D5.8(GND) D7.3(GND) D7.8(GND) D8.3(GND) D8.8(GND) D9.3(GND) D9.8(GND) D10.3(GND) D10.8(GND) D11.3(GND) D11.8(GND) J1.2(D2S) J1.5(D1S) J1.8(D0S) J1.11(CKS) J1.17(GND) J1.SH1(SH) J1.SH2(SH) J1.SH3(SH) J1.SH4(SH) J2.2(D2S) J2.5(D1S) J2.8(D0S) J2.11(CKS) J2.17(GND) J2.SH1(SH) J2.SH2(SH) J2.SH3(SH) J2.SH4(SH) J4.S1(SHIELD) J4.S2(SHIELD) LEFT_JOY.5 LEFT_JOY.6 LEFT_JOY.7 LEFT_JOY.8 OSC1.2(GND) Q2.2(E) R3.2 R4.1 R8.1 R10.1 R19.1 R25.1 R27.1 R28.1 R39.2 RIGTH_JOY.5 RIGTH_JOY.6 RIGTH_JOY.7 RIGTH_JOY.8 SW1.1 SW1.2 SW1.3 SW1.4 SW1.5 TP2.1 U1.1(GND) U1.2(GND) U1.7(GND) U1.8(GND) U1.13(GND) U1.14(GND) U1.22(GND) U1.23(GND) U1.32(GND) U1.33(GND) U1.42(GND) U1.43(GND) U1.52(GND) U1.53(GND) U1.59(GND) U1.60(GND) U1.65(GND) U1.66(GND) U1.71(GND) U1.74(GND) U1.98(GND) U1.108(GND) U1.114(GND) U1.120(GND) U1.126(GND) U1.132(GND) U1.138(GND) U1.144(GND) U1.150(GND) U1.156(GND) U1.162(GND) U1.168(GND) U1.174(GND) U1.180(GND) U1.186(GND) U1.192(GND) U1.198(GND) U2.1 U3.4(PGND) U3.19(PGND) U3.27(AGND) U4.2(GND) U5.5(PGND) U5.9(EP) U6.1 U7.1 U8.1 U8.4 U8.6 U8.7 U9.6 U9.9 U9.14 U9.20 U9.25 U9.30 U9.34 U9.39 U10.3(GND) U11.3(GND) U13.3(GND) U13.8(GND) U14.2(GND) U15.6(VSS) U15.SH@1(SH) U15.SH@2(SH) U16.3(GND) U16.8(GND) U17.4(PGND) U17.8(SGND) U17.9(EP) U18.1(PGND) U18.4(NC) U18.5(FB) U18.6(AGND) U18.11(EP) U19.12(VSSA) U19.18(VSS) U19.63(VSS) U20.2(GND) U21.2 U21.4 U21.5 U22.2 U22.4 U22.5 U23.2 U23.3 U23.4 U24.2 U24.3 U24.4 U25.2 U25.3 U25.4 U26.2 U26.3 U26.4 U27.1 U28.1 U29.1 U30.2 U30.5 U30.6 U31.1 U32.1 U33.1 U34.1 U35.1 U36.1 U37.1 U38.1 U39.1 U40.1 U41.1 U42.1 U43.1 U44.1(SHELL) U44.2(SHELL) U44.3(SHELL) U44.4(SHELL) U44.A1B12(GND) U44.B1A12(GND) U45.2(S) USB1.4(GND) USB1.7(GND_DRAIN) USB1.13(GND) USB1.16(GND_DRAIN) USB1.19(GND) USB1.20(GND) USB2.4(GND) USB2.5(GND) USB2.6(GND) USB3.5(GND) USB3.6(EH) X4.2
VBAT: B1.1 C3.2 C4.2 U1.76(VBAT) U2.3 U3.7(BATT) U3.16(BATT)
VBUS: C18.2 C24.2 C25.2 D1.2 R6.1 R7.2
VBUS_EN: U1.111(VBUS_EN) U4.3(EN/EN#)
ACOK: R16.1 U3.28(ACOK#) U19.10(PC2)
ADC1_IN0: C34.1 CN2.3 U19.14(PA0-WKUP(PA0))
ADC1_IN1: C35.1 CN2.4 U19.15(PA1)
ADC1_IN2: C36.1 LEFT_JOY.3 U19.16(PA2)
ADC1_IN3: C62.1 LEFT_JOY.4 U19.17(PA3)
ADC1_IN4: C38.1 RIGTH_JOY.3 U19.20(PA4)
ADC1_IN5: C37.1 RIGTH_JOY.4 U19.21(PA5)
BST1: C7.2 U3.23(BST1)
BST2: C8.2 U3.24(BST2)
BST3: C9.2 U3.15(BST3)
BT_nDISABLE: SW1.6 U1.91(BT_nDisable)
CC1: U1.94(CC1) U44.A5(CC1)
CC2: U1.96(CC2) U44.B5(CC2)
CM5_GPIO_IN: U1.25(GPIO21) U9.40 U19.9(PC1)
CM_5V: C1.2 C19.2 C65.2 CN1.4 TP1.1 U1.77(+5V) U1.79(+5V) U1.81(+5V) U1.83(+5V) U1.85(+5V) U1.87(+5V) U4.1(IN) U9.2 U9.4 U10.1(VIN) U12.2
D+: U20.1(I/O1) USB2.3(D+)
D-: U20.3(I/O2) USB2.2(D-)
EEPROM_nWP: SW1.9 U1.20(EEPROM_nWP)
EN_5V: U5.1(EN) U19.25(PC5)
ETH_LEDG: R24.1 U1.17(Ethernet_nLED2(3.3V))
ETH_LEDY: R23.2 U1.15(Ethernet_nLED3(3.3V))
FB: C44.1 R26.1 R27.2 U17.1(FB)
FB1: C31.1 R9.1 R10.2 U5.2(FB)
GPIO2: U1.58(GPIO2) U9.3
GPIO3: U1.56(GPIO3) U9.5
GPIO4: U1.54(GPIO4) U9.7
GPIO5: U1.34(GPIO5) U9.29
GPIO6: U1.30(GPIO6) U9.31
GPIO7: U1.37(GPIO7) U9.26
GPIO8: U1.39(GPIO8) U9.24
GPIO9: U1.40(GPIO9) U9.21
GPIO10: U1.44(GPIO10) U9.19
GPIO11: U1.38(GPIO11) U9.23
GPIO12: U1.31(GPIO12) U9.32
GPIO13: U1.28(GPIO13) U9.33
GPIO14: U1.55(GPIO14) U9.8 U19.42(PA9)
GPIO15: U1.51(GPIO15) U9.10 U19.43(PA10)
GPIO16: U1.29(GPIO16) U9.36 U19.45(PA12)
GPIO17: U1.50(GPIO17) U9.11 U19.44(PA11)
GPIO18: U1.49(GPIO18) U9.12
GPIO19: U1.26(GPIO19) U9.35
GPIO20: U1.27(GPIO20) U9.38
GPIO22: U1.46(GPIO22) U9.15
GPIO23: U1.47(GPIO23) U9.16
GPIO24: U1.45(GPIO24) U9.18
GPIO25: U1.41(GPIO25) U9.22
GPIO26: U1.24(GPIO26) U9.37
GPIO27: U1.48(GPIO27) U9.13
GPIO_IN0: U19.61(PB8) U21.1
GPIO_IN1: U19.62(PB9) U21.3
GPIO_IN2: U19.29(PB10) U22.1
GPIO_IN3: U19.30(PB11) U22.3
GPIO_IN4: U19.33(PB12) U23.1
GPIO_IN5: U19.34(PB13) U24.1
GPIO_IN6: U19.35(PB14) U25.1
GPIO_IN7: U19.36(PB15) U26.1
GPIO_VREF: R14.2 R15.2 R21.2 R22.2 U1.78(GPIO_VREF(1.8v/3.3v_Input))
HDMI0_CEC: J1.13(CEC) U1.151(HDMI0_CEC) U42.2
HDMI0_CK_N: D11.5(I/O_4) D11.6(NC) J1.12(CK-) U1.190(HDMI0_CLK_N)
HDMI0_CK_P: D11.4(I/O_3) D11.7(NC) J1.10(CK+) U1.188(HDMI0_CLK_P)
HDMI0_D0_N: D11.2(I/O) D11.9(NC) J1.9(D0-) U1.184(HDMI0_TX0_N)
HDMI0_D0_P: D11.1(I/O) D11.10(NC) J1.7(D0+) U1.182(HDMI0_TX0_P)
HDMI0_D1_N: D5.5(I/O_4) D5.6(NC) J1.6(D1-) U1.178(HDMI0_TX1_N)
HDMI0_D1_P: D5.4(I/O_3) D5.7(NC) J1.4(D1+) U1.176(HDMI0_TX1_P)
HDMI0_D2_N: D5.2(I/O) D5.9(NC) J1.3(D2-) U1.172(HDMI0_TX2_N)
HDMI0_D2_P: D5.1(I/O) D5.10(NC) J1.1(D2+) U1.170(HDMI0_TX2_P)
HDMI0_HOTPLUG: J1.19(HPD/HEAC-) U1.153(HDMI0_HOTPLUG)
HDMI0_SCL: J1.15(SCL) U1.200(HDMI0_SCL) U43.2
HDMI0_SDA: J1.16(SDA) U1.199(HDMI0_SDA) U41.2
HDMI1_CEC: J2.13(CEC) U1.149(HDMI1_CEC) U7.2
HDMI1_CK_N: D10.5(I/O_4) D10.6(NC) J2.12(CK-) U1.166(HDMI1_CLK_N)
HDMI1_CK_P: D10.4(I/O_3) D10.7(NC) J2.10(CK+) U1.164(HDMI1_CLK_P)
HDMI1_D0_N: D10.2(I/O) D10.9(NC) J2.9(D0-) U1.160(HDMI1_TX0_N)
HDMI1_D0_P: D10.1(I/O) D10.10(NC) J2.7(D0+) U1.158(HDMI1_TX0_P)
HDMI1_D1_N: D9.5(I/O_4) D9.6(NC) J2.6(D1-) U1.154(HDMI1_TX1_N)
HDMI1_D1_P: D9.4(I/O_3) D9.7(NC) J2.4(D1+) U1.152(HDMI1_TX1_P)
HDMI1_D2_N: D9.2(I/O) D9.9(NC) J2.3(D2-) U1.148(HDMI1_TX2_N)
HDMI1_D2_P: D9.1(I/O) D9.10(NC) J2.1(D2+) U1.146(HDMI1_TX2_P)
HDMI1_HOTPLUG: J2.19(HPD/HEAC-) U1.143(HDMI1_HOTPLUG)
HDMI1_SCL: J2.15(SCL) U1.147(HDMI1_SCL) U6.2
HDMI1_SDA: J2.16(SDA) U1.145(HDMI1_SDA) U40.2
HDMI_5v: C2.2 J1.18(+5V) J2.18(+5V) TP3.1 U10.2(VOUT)
I2C1_SCL: R33.1 U3.11(SCL) U19.58(PB6)
I2C1_SDA: R32.1 U3.10(SDA) U19.59(PB7)
ID_SC: H1.1 U1.35(ID_SC) U9.28
ID_SD: H1.3 U1.36(ID_SD) U9.27
IN: C11.2 R5.1 R7.1 U3.1(IN) U3.22(IN)
INT: R18.1 U3.9(INT#) U19.24(PC4)
LED_GREEN: R34.1 U19.40(PC9)
LED_nACT: R13.1 U1.21(LED_nACT)
LED_RED: R20.1 U19.39(PC8)
M2_3v3: C44.2 C45.2 C46.2 C47.2 C48.2 C52.2 CN3.2(VCC 3.3) CN3.4(VCC 3.3) CN3.12(VCC 3.3) CN3.14(VCC 3.3) CN3.16(VCC 3.3) CN3.18(VCC 3.3) CN3.70(VCC 3.3) CN3.72(VCC3.3) CN3.74(VCC 3.3) GREEN_LED1.1(A) L1.2 OSC1.1(Tri-state) OSC1.4(VDD) R26.2
MCU_3V3: BUZZER1.1(+) C49.2 C53.2 C54.2 C55.2 C56.2 C57.2 C58.2 C63.3(OUT) CN2.1 CN2.2 D4.1(K) LEFT_JOY.1 LEFT_JOY.2 R16.2 R17.2 R18.2 R29.1 R32.2 R33.2 R35.2 R38.1 RIGTH_JOY.1 RIGTH_JOY.2 U18.8(SLEEP) U19.1(VBAT) U19.13(VDDA) U19.19(VDD) U19.32(VDD) U19.48(VDD) U19.64(VDD)
nPWR_LED: U1.95(LED_nPWR) U11.2(A)
nRPIBOOT: SW1.10 U1.93(nRPIBOOT)
NTC: R2.1 R3.1 U2.2 U3.3(NTC)
OFF/ON_CM5: R12.1 U19.26(PB0)
PCIE_CLK_N: CN3.53(PEREFCLKN) U1.112(PCIe_CLK_N)
PCIE_CLK_P: CN3.55(PEREFCLKP) U1.110(PCIe_CLK_P)
PCIE_nCLKREQ: CN3.52(PECLKREQ#) U1.102(PCIe_CLK_nREQ)
PCIE_nRST: CN3.50(PERST#) U1.109(PCIe_nRST)
PCIE_nWAKE: CN3.54(PEWAKE#) U1.104(PCIe_nWAKE)
PCIE_PWR_EN: R25.2 U1.106(PCIe_PWR_EN) U17.7(EN)
PCIE_RX_N: CN3.43(SATA-B-(RX)/PERp0) U1.118(PCIe_RX_N)
PCIE_RX_P: CN3.41(SATA-B+(RX)/PERn0) U1.116(PCIe_RX_P)
PCIE_TX_N: CN3.49(SATA-A+(TX)/PETp0) U1.124(PCIe_TX_N)
PCIE_TX_P: CN3.47(SATA-A-(TX)/PETn0) U1.122(PCIe_TX_P)
PROCHOT: R17.1 U3.8(PROCHOT#) U19.11(PC3)
PWM: CN1.3 U1.19(FAN_PWM)
PWR_BUT: U1.92(PWR_BUT) U45.3(D)
PWRB_STM32: C66.1 R35.1 U8.5 U19.37(PC6)
SCL1: H1.2 R15.1
SD_CLK: D7.2(IO2) D7.9(NC) U1.57(SD_CLK) U15.5(CLK)
SD_CMD: D7.1(IO1) D7.10(NC) U1.62(SD_CMD) U15.3(CMD)
SD_DAT0: D7.4(IO3) D7.7(NC) U1.63(SD_DAT0) U15.7(DAT0)
SD_DAT1: D7.5(IO4) D7.6(NC) U1.67(SD_DAT1) U15.8(DAT1)
SD_DAT2: D8.2(IO2) D8.9(NC) U1.69(SD_DAT2) U15.1(DAT2)
SD_DAT3: D8.4(IO3) D8.7(NC) U1.61(SD_DAT3) U15.2(CD_DAT3)
SD_PWR: C39.2 U14.1(VOUT) U15.4(VDD)
SD_PWR_ON: U1.75(SD_PWR_ON) U14.4(EN/EN#)
SDA1: H1.4 R14.1
SW1: C7.1 L5.2 U3.21(SW1)
SW2: C8.1 L2.2 U3.20(SW2)
SW3: C9.1 L2.1 L5.1 U3.18(SW3)
SWCLK: R39.1 U19.49(PA14(JTCK-SWCLK)) U30.4
SWD_5V: C61.3(OUT) D3.2(A)
SWDIO: R38.2 U19.46(PA13(JTMS-SWDIO)) U30.3
SYS: C13.2 C14.2 C15.2 C16.2 C17.2 C27.2 C28.2 C29.2 D2.2(A) U3.6(SYS) U3.17(SYS) U5.8(VIN)
TACHO: CN1.1 U1.16(FAN_TACHO)
TIM3_CH4: R40.1 U19.27(PB1)
TR0_TAP: H2.3 J4.11(VC1)
TR1_TAP: H2.1 J4.12(VC2)
TR2_TAP: H2.2 J4.13(VC3)
TR3_TAP: H2.4 J4.14(VC4)
TRD0_N: J4.2(TD1-) U1.10(Ethernet_Pair0_N) U16.4(D2+) U16.7(N.C.)
TRD0_P: J4.1(TD1+) U1.12(Ethernet_Pair0_P) U16.5(D2-) U16.6(N.C.)
TRD1_N: J4.6(TD2-) U1.6(Ethernet_Pair1_N) U16.2(D1-) U16.9(N.C.)
TRD1_P: J4.3(TD2+) U1.4(Ethernet_Pair1_P) U16.1(D1+) U16.10(N.C.)
TRD2_N: J4.8(TD3-) U1.9(Ethernet_Pair2_N) U13.4(D2+) U13.7(N.C.)
TRD2_P: J4.7(TD3+) U1.11(Ethernet_Pair2_P) U13.5(D2-) U13.6(N.C.)
TRD3_N: J4.10(TD4-) U1.5(Ethernet_Pair3_N) U13.2(D1-) U13.9(N.C.)
TRD3_P: J4.9(TD4+) U1.3(Ethernet_Pair3_P) U13.1(D1+) U13.10(N.C.)
USB2_N: R36.1 U1.103(USB2_N)
USB2_P: R37.2 U1.105(USB2_P)
USB3-0-D_N: U1.136(USB3-0-D_N) U31.2 USB1.2(D-)
USB3-0-D_P: U1.134(USB3-0-D_P) U27.2 USB1.3(D+)
USB3-0-RX_N: U1.128(USB3-0-RX_N) U37.2 USB1.6(SSRX+)
USB3-0-RX_P: U1.130(USB3-0-RX_P) U36.2 USB1.5(SSRX-)
USB3-0-TX_N: U1.140(USB3-0-TX_N) U38.2 USB1.9(SSTX+)
USB3-0-TX_P: U1.142(USB3-0-TX_P) U39.2 USB1.8(SSTX-)
USB3-1-D_N: U1.165(USB3-1-D-N) U29.2 USB1.11(D-)
USB3-1-D_P: U1.163(USB3-1-D-P) U28.2 USB1.12(D+)
USB3-1-RX_N: U1.157(USB3-1-RX-N) U35.2 USB1.15(SSRX+)
USB3-1-RX_P: U1.159(USB3-1-RX-P) U34.2 USB1.14(SSRX-)
USB3-1-TX_N: U1.169(USB3-1-TX-N) U32.2 USB1.18(SSTX+)
USB3-1-TX_P: U1.171(USB3-1-TX-P) U33.2 USB1.17(SSTX-)
USBOTG_ID: SW1.8 U1.101(USB_OTG_ID)
WIFI_nDISABLE: SW1.7 U1.89(WiFi_nDisable)
Net-(BUZZER1-2): BUZZER1.2 D4.2(A) Q2.3(C)
Net-(C5-2): C5.2 R1.1
Net-(C6-2): C6.2 R2.2 U3.2(VNTC)
Net-(C10-1): C10.1 R5.2 U3.30(IAN)
Net-(C10-2): C10.2 R6.2 U3.29(IAP)
Net-(C12-2): C12.2 U3.26(VCC)
Net-(C23-2): C23.2 U5.4(SS)
Net-(C26-2): C26.2 U5.3(VREG5)
Net-(C30-1): C30.1 L3.1 U5.6(SW)
Net-(C30-2): C30.2 U5.7(BOOT)
Net-(C40-2): C40.2 J4.4(CT1) J4.5(CT2)
Net-(C50-2): C50.2 D2.1(K) D3.1(K) U18.2(VIN) U18.3(EN)
Net-(C51-2): C51.2 C63.1(IN) L4.2 R30.2 U18.10(VOS)
Net-(C59-2): C59.2 U19.47(VCAP_2)
Net-(C60-2): C60.2 U19.31(VCAP_1)
Net-(C61-1): C61.1(IN) U30.1
Net-(CN3-10): CN3.10(DAS/DSS) R31.2
Net-(CN3-68): CN3.68(PESUSCLK) OSC1.3(OUTPUT)
Net-(D1-1): D1.1 U44.A4B9(VBUS) U44.B4A9(VBUS)
Net-(GREEN_LED1-2): GREEN_LED1.2(K) R31.1
Net-(GREEN_LED-2): GREEN_LED.2(K) R13.2
Net-(J3-1): J3.1 U1.73(SD_VDD_Override)
Net-(J4-16): J4.16(GC) R23.1
Net-(J4-18): J4.18(YC) R24.2
Net-(L1-1): L1.1 U17.6(LX)
Net-(L4-1): L4.1 U18.9(SW)
Net-(Q2-1): Q2.1(B) R40.2
Net-(R1-2): R1.2 U3.25(VMAX_BST)
Net-(R4-2): R4.2 U3.5(OTG)
Net-(R8-2): R8.2 U4.5(ILIM)
Net-(R11-1): R11.1 U11.4(Y)
Net-(R11-2): R11.2 RED_LED.2(K)
Net-(R12-2): R12.2 R19.2 U45.1(G)
Net-(R20-2): R20.2 U8.3
Net-(R28-2): R28.2 U19.60(BOOT0)
Net-(R29-2): R29.2 U19.7(NRST)
Net-(R30-1): R30.1 U18.7(PG)
Net-(R34-2): R34.2 U8.2
Net-(R36-2): R36.2 U20.4(I/O2)
Net-(R37-1): R37.1 U20.6(I/O1)
Net-(U1.2-107): U1.107(GND) U1.113(GND) U1.119(GND) U1.125(GND) U1.131(GND) U1.137(GND) U1.155(GND) U1.161(GND) U1.167(GND) U1.173(GND) U1.179(GND) U1.185(GND) U1.191(GND) U1.197(GND)
Net-(U19.1-5): U19.5(PH0-OSC_IN(PH0)) X4.1
Net-(U19.1-6): U19.6(PH1-OSC_OUT(PH1)) X4.3

Not connected (* = marked no-connect by the designer): BUZZER1 3* 4*; CN3 1(CONFIG_3)* 5(PERn3)* 6(N/A)* 7(PERp3)* 8(N/A)* 11(PETn3)* 13(PETp3)* 17(PERn2)* 19(PERp2)* 20(N/A)* 21(CONFIG_0)* 22(N/A)* 23(PETn2)* 24(N/A)* 25(PETp2)* 26(N/A)* 28(N/A)* 29(PERn1)* 30(N/A)* 31(PERp1)* 32(N/A)* 34(N/A)* 35(PETn1)* 36(N/A)* 37(PETp1)* 38(DEVSLP)* 40(N/A)* 42(N/A)* 44(N/A)* 46(N/A)* 48(N/A)* 56(MFG1)* 58(MFG2)* 67(N/A)* 69(CONFIG_1)* 75(CONFIG_2)*; D8 1(IO1)* 5(IO4)* 6(NC)* 10(NC)*; J1 14(UTILITY/HEAC+); J2 14(UTILITY/HEAC+); U1 18(Ethernet_SYNC_OUT(3.3v)) 64(SD_DAT5) 68(SD_DAT4) 70(SD_DAT7) 72(SD_DAT6) 80(SCL0) 82(SDA0) 97(CAM_GPIO0) 99(PMIC_ENABLE) 100(CAM_GPIO1) 115(MIPI0_D0_N) 117(MIPI0_D0_P) 121(MIPI0_D1_N) 123(MIPI0_D1_P) 127(MIPI0_C_N) 129(MIPI0_C_P) 133(MIPI0_D2_N) 135(MIPI0_D2_P) 139(MIPI0_D3_N) 141(MIPI0_D3_P) 175(MIPI1_D0_N) 177(MIPI1_D0_P) 181(MIPI1_D1_N) 183(MIPI1_D1_P) 187(MIPI1_C_N) 189(MIPI1_C_P) 193(MIPI1_D2_N) 194(MIPI1_D3_N) 195(MIPI1_D2_P) 196(MIPI1_D3_P); U3 12(PSYS)* 13(IBM)* 14(IAM)*; U4 4(FAULT#)*; U11 1(NC)*; U14 3(FLG#)*; U17 2(PG)* 5(NC)*; U19 2(PC13)* 3(PC14-OSC32_IN(PC14))* 4(PC15-OSC32_OUT(PC15))* 22(PA6)* 23(PA7)* 28(PB2-BOOT1(PB2))* 38(PC7)* 41(PA8)* 50(PA15(JTDI))* 51(PC10)* 52(PC11)* 53(PC12)* 54(PD2)* 55(PB3(JTDOTRACESWO))* 56(PB4(NJTRST))* 57(PB5)*; U44 A6(DP1)* A7(DN1)* A8(SBU1)* B6(DP2)* B7(DN2)* B8(SBU2)*; USB3 2(D-)* 3(D+)* 4(ID)*

## Notes on the sheets
sheet 1
- CM5 2/2
- SWITCH_PAD
- ЗАЩИТА
- Служат для подключения EEPROM дисплеев/камер к основной I²C-шине
- 1) USB3 / HDMI — ставьте низкоёмкостный TVS-массив у каждого коннектора. Позиция: прямо у ножек разъёма (по максимуму ближе к штырям).
- Подключайте корпус экрана и общую землю правильно. Если используете ESD5311N на USB — это нормальная практика
- (он рассчитан на USB2/частично USB3-линии), но для SuperSpeed пар лучше подобрать специально заявленный “USB3/HDMI” TVS.
- 2)USB2 / SD — можно ставить 4-канальные ESD массивы (один компонент на весь разъём SD или USB2).
- R-сет (22–33 Ом) в линиях D+/D– перед PHY/коннектором — хорошая практика.
- 3)Ethernet — у вас уже есть MagJack с трансформаторами. Дополнительно ставьте TVS по каждой паре
- (обычно “4-pair TVS array” или по-парно) и Common-mode choke (если не интегрирован в разъём).
- SWITCH_PAD
- USB3.0
- USB2.0
- ESD/TVS ставится максимально близко к разъёму (физически — рядом с корпусом коннектора).
- USB
- Поставьте 22 Ω сериес резисторы ближе к PHY (SoC).
  Параллельно D+ D− не должно быть больших ёмкостей.
- . Практические layout / размещение компонентов (обязательно)
  IN конденсаторы (C19) как можно ближе к IN ножке AP22653.
  OUT конденсаторы (C20, C21, C22) как можно ближе к OUT и к разъёму USB.
  Trace width: для VBUS и GND используйте широкие полигоны и много via. VBUS должен выдерживать ток.
  EN/FAULT линии — к MCU/CM5 по коротким трекам с pull-ups/pull-downs по референсу.
  Обеспечьте тепловой отвод для AP22653 (при длительных токах греется).
- с27(необязателен) - если сигнал стабильный, то не паять!
- После DC-DC И ФИЛЬТРА LC ШИНА (5V)
- USB2.0 вопрос остается открытым, нужно ли нам подключать его на type-c или можно сделать еще один порт
- HDMIx2
- для сигналов HDMI обеспечивают дифференциальное сопротивление 100 Ом.
- Защита для HDMI
- После DC-DC И ФИЛЬТРА LC ШИНА (5V)
sheet 2
- Power Display
- Power type-c
- DC-DC MCU 3.3V
- Low Pass Filter
- DC-DC PCIE 3.3V
- Charging & power path
- DC-DC 5.0V
- Выходом данного блока
  является шина SYS ≈ 8V
sheet 3
- Если у вас CM5 без встроенного Wi-Fi/BT, то WL_nDIS и BT_nDIS можно не подключать, они не используются.
  Если у вас CM5-W (со встроенным радиомодулем), то они будут управлять включением беспроводной части. В IO-плате обычно их подтягивают к VCC (через резистор), чтобы радиочасть включалась автоматически
- SD_CARD
- CM5 1/2
- Для uart можно поставить 100 ом
- ВОПРОС НАСЧЕТ ПИТАНИЯ +3.3V
- FAN
- SWITCH
- LAN
- Инструкция к SWITCH
- EEPROM_nWP включает аппаратную защиту от записи в
  EEPROM для предотвращения изменения данных.
  Опустите этот штифт, чтобы конечные пользователи не могли изменять
  содержимое встроенного EEPROM. Инструкции по настройке программного
  обеспечения приведены в документации по защите EEPROM от записи.
- Если загрузчик работает не так, как ожидалось, включите диагностические режимы:
- замкните контакт nRPIBOOT на землю чтобы принудительно включить режим загрузки по USB.
- PWR_INDICATOR
- USBOTG_ID нужен, чтобы CM5 понимал, быть ему USB-хостом или USB-устройством.
- Если заземлить — всегда хост. Если оставить открытым — будет работать как устройство (USB gadget).
- Если заземлить WIFI_nDISABLE и BT_nDISABLE - устройства вайфай и блютуз будут выключены.
- Логическая единица - включены.
- JUMPER
- При соединении питание идет с LAN
- PCI_SSD
sheet 4
- Buzzer
- PWR_BUTT
- Pull-up
- Joystick Left
- Joystick Right
- Camera Gimbal
- 2 pos swith
- 2 pos swith
- 3 pos swith
- Button
- SWD
- MCU
- 3 pos swith
- Button
- POWER MCU
- LPF filter ADC
- Pwr_Butt_CM5
